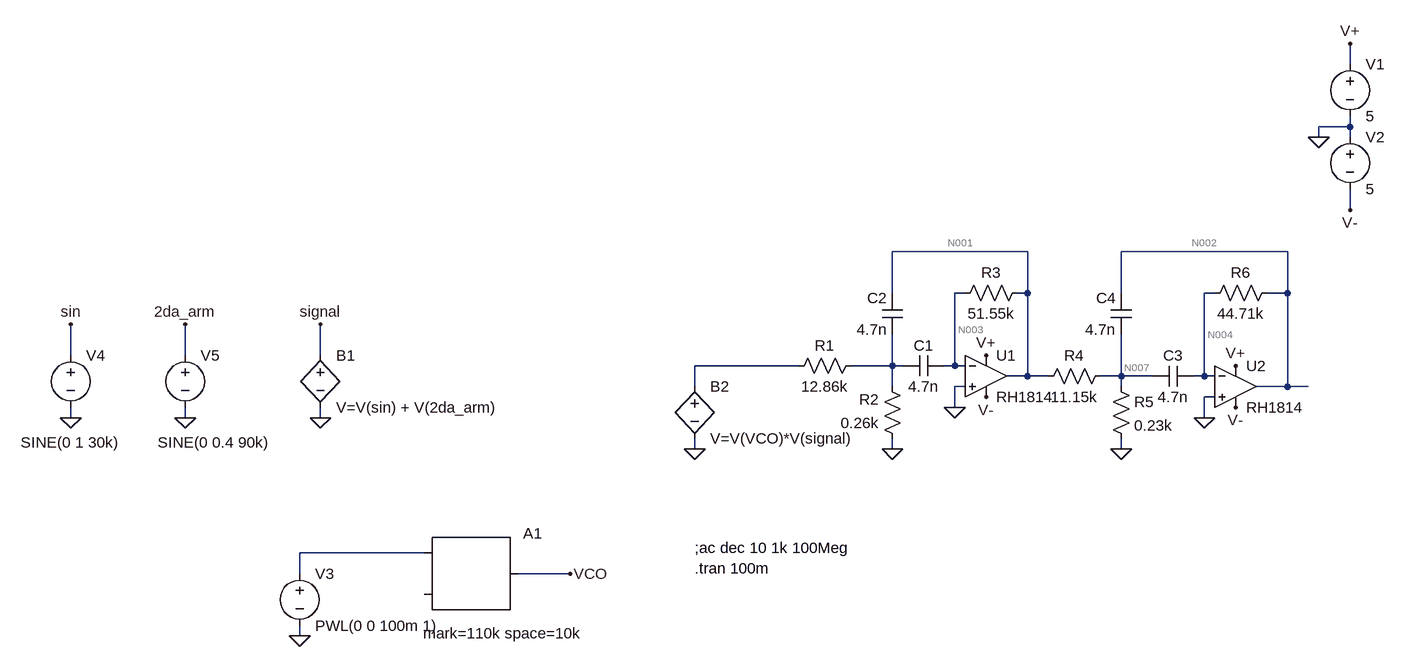
[diagram p0: schematic spectrum_analyzer.asc]
spectrum_analyzer.asc, the LTspice schematic file:
Version 4
SHEET 1 880 680
WIRE 672 -400 672 -432
WIRE 672 -304 672 -320
WIRE 672 -304 624 -304
WIRE 624 -288 624 -304
WIRE 672 -288 672 -304
WIRE 672 -176 672 -208
WIRE 176 -112 -32 -112
WIRE 576 -112 320 -112
WIRE -32 -48 -32 -112
WIRE 80 -48 64 -48
WIRE 176 -48 176 -112
WIRE 176 -48 160 -48
WIRE 320 -48 320 -112
WIRE 464 -48 448 -48
WIRE 576 -48 576 -112
WIRE 576 -48 544 -48
WIRE -1296 48 -1296 0
WIRE -1120 48 -1120 0
WIRE -912 48 -912 0
WIRE -176 64 -336 64
WIRE -32 64 -32 16
WIRE -32 64 -96 64
WIRE -16 64 -32 64
WIRE 64 64 64 -48
WIRE 64 64 48 64
WIRE 80 64 64 64
WIRE 176 80 176 -48
WIRE 176 80 144 80
WIRE 208 80 176 80
WIRE 320 80 320 16
WIRE 320 80 288 80
WIRE 368 80 320 80
WIRE 448 80 448 -48
WIRE 448 80 432 80
WIRE 464 80 448 80
WIRE -336 96 -336 64
WIRE -32 96 -32 64
WIRE 80 96 64 96
WIRE 320 96 320 80
WIRE 576 96 576 -48
WIRE 576 96 528 96
WIRE 608 96 576 96
WIRE 464 112 448 112
WIRE 64 128 64 96
WIRE -1296 144 -1296 128
WIRE -1120 144 -1120 128
WIRE -912 144 -912 128
WIRE 448 144 448 112
WIRE -336 192 -336 176
WIRE -32 192 -32 176
WIRE 320 192 320 176
WIRE -752 352 -944 352
WIRE -944 384 -944 352
WIRE -528 384 -608 384
WIRE -944 480 -944 464
FLAG 624 -288 0
FLAG 672 -432 V+
FLAG 672 -176 V-
FLAG -32 192 0
FLAG 64 128 0
FLAG 320 192 0
FLAG 448 144 0
FLAG 112 48 V+
FLAG 496 64 V+
FLAG 112 112 V-
FLAG 496 128 V-
FLAG -944 480 0
FLAG -528 384 VCO
FLAG -336 192 0
FLAG -912 144 0
FLAG -1120 144 0
FLAG -1296 144 0
FLAG -1296 0 sin
FLAG -1120 0 2da_arm
FLAG -912 0 signal
SYMBOL voltage 672 -416 R0
WINDOW 123 0 0 Left 2
WINDOW 39 0 0 Left 2
SYMATTR InstName V1
SYMATTR Value 5
SYMBOL voltage 672 -304 R0
WINDOW 123 0 0 Left 2
WINDOW 39 0 0 Left 2
SYMATTR InstName V2
SYMATTR Value 5
SYMBOL res -80 48 R90
WINDOW 0 0 56 VBottom 2
WINDOW 3 32 56 VTop 2
SYMATTR InstName R1
SYMATTR Value 12.86k
SYMBOL res -16 192 R180
WINDOW 0 36 76 Left 2
WINDOW 3 36 40 Left 2
SYMATTR InstName R2
SYMATTR Value 0.26k
SYMBOL res 64 -32 R270
WINDOW 0 32 56 VTop 2
WINDOW 3 0 56 VBottom 2
SYMATTR InstName R3
SYMATTR Value 51.55k
SYMBOL res 192 96 R270
WINDOW 0 32 56 VTop 2
WINDOW 3 0 56 VBottom 2
SYMATTR InstName R4
SYMATTR Value 11.15k
SYMBOL res 304 80 R0
SYMATTR InstName R5
SYMATTR Value 0.23k
SYMBOL res 560 -64 R90
WINDOW 0 0 56 VBottom 2
WINDOW 3 32 56 VTop 2
SYMATTR InstName R6
SYMATTR Value 44.71k
SYMBOL cap 48 48 R90
WINDOW 0 0 32 VBottom 2
WINDOW 3 32 32 VTop 2
SYMATTR InstName C1
SYMATTR Value 4.7n
SYMBOL cap -16 16 R180
WINDOW 0 24 56 Left 2
WINDOW 3 24 8 Left 2
SYMATTR InstName C2
SYMATTR Value 4.7n
SYMBOL cap 432 64 R90
WINDOW 0 0 32 VBottom 2
WINDOW 3 32 32 VTop 2
SYMATTR InstName C3
SYMATTR Value 4.7n
SYMBOL cap 336 16 R180
WINDOW 0 24 56 Left 2
WINDOW 3 24 8 Left 2
SYMATTR InstName C4
SYMATTR Value 4.7n
SYMBOL Opamps\\RH1814 112 80 R0
SYMATTR InstName U1
SYMBOL Opamps\\RH1814 496 96 R0
SYMATTR InstName U2
SYMBOL SpecialFunctions\\modulate -752 352 R0
WINDOW 3 -2 124 Left 2
SYMATTR Value mark=110k space=10k
SYMATTR InstName A1
SYMBOL voltage -944 368 R0
WINDOW 123 0 0 Left 2
WINDOW 39 0 0 Left 2
SYMATTR InstName V3
SYMATTR Value PWL(0 0 100m 1)
SYMBOL voltage -1296 32 R0
WINDOW 3 -77 150 Left 2
WINDOW 123 0 0 Left 2
WINDOW 39 0 0 Left 2
SYMATTR Value SINE(0 1 30k)
SYMATTR InstName V4
SYMBOL voltage -1120 32 R0
WINDOW 3 -42 150 Left 2
WINDOW 123 0 0 Left 2
WINDOW 39 0 0 Left 2
SYMATTR Value SINE(0 0.4 90k)
SYMATTR InstName V5
SYMBOL bv -912 32 R0
SYMATTR InstName B1
SYMATTR Value V=V(sin) + V(2da_arm)
SYMBOL bv -336 80 R0
SYMATTR InstName B2
SYMATTR Value V=V(VCO)*V(signal)
TEXT -336 344 Left 2 !;ac dec 10 1k 100Meg
TEXT -336 376 Left 2 !.tran 100m

The netlist it stands for:
* spectrum_analyzer.asc
V1 V+ 0 5
V2 0 V- 5
R1 N006 N005 12.86k
R2 0 N006 0.26k
R3 N003 N001 51.55k
R4 N001 N007 11.15k
R5 N007 0 0.23k
R6 N002 N004 44.71k
C1 N003 N006 4.7n
C2 N006 N001 4.7n
C3 N004 N007 4.7n
C4 N007 N002 4.7n
* U1: RH1814 (symbol Opamps\RH1814 not available, pins judged from their places): In+=0 In-=N003 V+=V+ V-=V- OUT=N001
* U2: RH1814 (symbol Opamps\RH1814 not available, pins judged from their places): In+=0 In-=N004 V+=V+ V-=V- OUT=N002
A1 N008 0 0 0 0 0 VCO 0 MODULATOR mark=110k space=10k
V3 N008 0 PWL(0 0 100m 1)
V4 sin 0 SINE(0 1 30k)
V5 2da_arm 0 SINE(0 0.4 90k)
B1 signal 0 V=V(sin) + V(2da_arm)
B2 N005 0 V=V(VCO)*V(signal)
;ac dec 10 1k 100Meg
.tran 100m
.backanno
.end

* Results of the author's LTspice run, read from the files saved beside the schematic
* Operating Point, zero values left out:
*   V(v+) = 5 V
*   V(v-) = -5 V
*   V(n003) = 16.27 µV
*   V(n001) = -46.41 mV
*   V(n007) = -938 µV
*   V(n002) = -40.25 mV
*   V(n004) = 14.09 µV
*   I(R6) = -900.6 nA
*   I(R5) = -4.078 µA
*   I(R4) = -4.078 µA
*   I(R3) = 900.6 nA
*   I(V2) = -6 mA
*   I(V1) = -5.997 mA
*   Ix(u1:1) = -900.6 nA
*   Ix(u1:2) = -900.6 nA
*   Ix(u1:3) = 2.998 mA
*   Ix(u1:4) = -3.001 mA
*   Ix(u1:5) = 4.979 µA
*   Ix(u2:1) = -900.6 nA
*   Ix(u2:2) = -900.6 nA
*   Ix(u2:3) = 3 mA
*   Ix(u2:4) = -2.999 mA
*   Ix(u2:5) = 900.6 nA